# Altium schematic sheet GPS_NMEA.SchDoc
size B
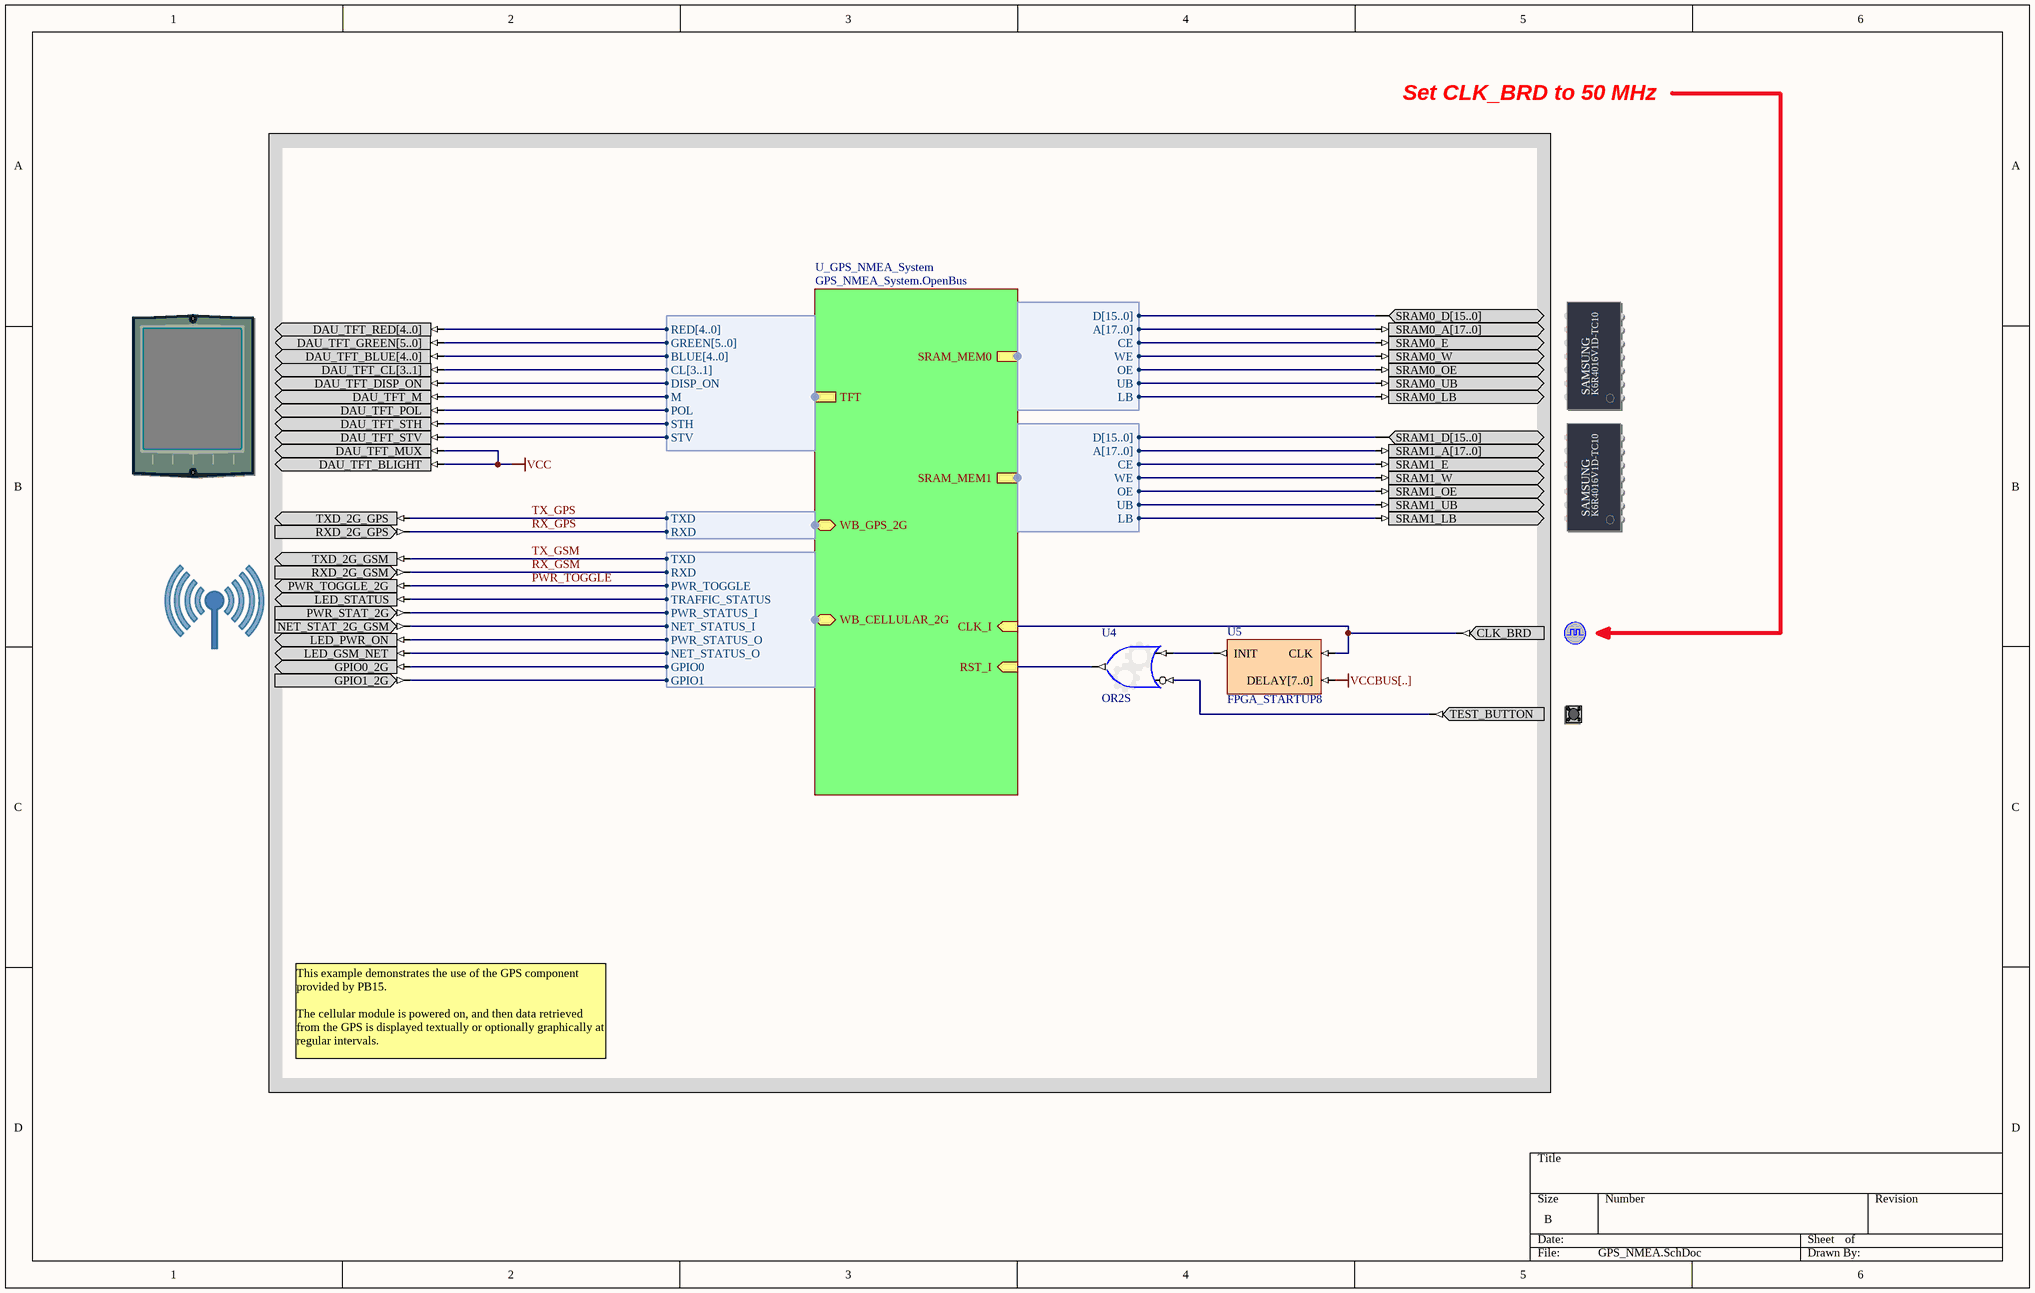
[diagram p0: GPS_NMEA.SchDoc]

## Parts
(Parts that share a designator on the sheet are numbered #1, #2 ... from top to bottom, then left to right.)
?#1  TFT_LCD  (value not drawn)
?#2  SRAM_DAUGHTER0  (value not drawn)
?#3  SRAM_DAUGHTER1  (value not drawn)
?#4  2G_GPS_COMP  (value not drawn)
?#5  2G_GSM_COMP  (value not drawn)
?#6  CLOCK_BOARD  (value not drawn)
?#7  TEST_BUTTON  (value not drawn)
U4  OR2S
U5  FPGA_STARTUP8

## Sub-sheets
U_GPS_NMEA_System = GPS_NMEA_System.OpenBus: SRAM_MEM0 (harness WB_MEM_CTRL_SRAM16_A18), SRAM_MEM1 (harness WB_MEM_CTRL_SRAM16_A18), TFT (harness VGA32_TFT), RST_I (in), CLK_I (in), WB_CELLULAR_2G (harness WB_CELLULAR_2G), WB_GPS_2G (harness WB_GPS_NMEA)

## Harnesses
WB_MEM_CTRL_SRAM16_A18: D[15..0], A[17..0], CE, WE, OE, UB, LB
VGA32_TFT: RED[4..0], GREEN[5..0], BLUE[4..0], CL[3..1], DISP_ON, M, POL, STH, STV
WB_CELLULAR_2G: TXD, RXD, PWR_TOGGLE, TRAFFIC_STATUS, PWR_STATUS_I, NET_STATUS_I, PWR_STATUS_O, NET_STATUS_O, GPIO0, GPIO1
WB_GPS_NMEA: RXD, TXD

## Nets
VCC: ?#1.DAU_TFT_BLIGHT ?#1.DAU_TFT_MUX
VCCBUS[..]: U5.DELAY[7..0]
PWR_TOGGLE: ?#5.PWR_TOGGLE_2G ; sheet U_GPS_NMEA_System/WB_CELLULAR_2G.PWR_TOGGLE
RX_GPS: ?#4.RXD_2G_GPS ; sheet U_GPS_NMEA_System/WB_GPS_2G.RXD
RX_GSM: ?#5.RXD_2G_GSM ; sheet U_GPS_NMEA_System/WB_CELLULAR_2G.RXD
TX_GPS: ?#4.TXD_2G_GPS ; sheet U_GPS_NMEA_System/WB_GPS_2G.TXD
TX_GSM: ?#5.TXD_2G_GSM ; sheet U_GPS_NMEA_System/WB_CELLULAR_2G.TXD
Net?#1_DAU_TFT_BLUE[4..0]: ?#1.DAU_TFT_BLUE[4..0] ; sheet U_GPS_NMEA_System/TFT.BLUE[4..0]
Net?#1_DAU_TFT_CL[3..1]: ?#1.DAU_TFT_CL[3..1] ; sheet U_GPS_NMEA_System/TFT.CL[3..1]
Net?#1_DAU_TFT_DISP_ON: ?#1.DAU_TFT_DISP_ON ; sheet U_GPS_NMEA_System/TFT.DISP_ON
Net?#1_DAU_TFT_GREEN[5..0]: ?#1.DAU_TFT_GREEN[5..0] ; sheet U_GPS_NMEA_System/TFT.GREEN[5..0]
Net?#1_DAU_TFT_M: ?#1.DAU_TFT_M ; sheet U_GPS_NMEA_System/TFT.M
Net?#1_DAU_TFT_POL: ?#1.DAU_TFT_POL ; sheet U_GPS_NMEA_System/TFT.POL
Net?#1_DAU_TFT_RED[4..0]: ?#1.DAU_TFT_RED[4..0] ; sheet U_GPS_NMEA_System/TFT.RED[4..0]
Net?#1_DAU_TFT_STH: ?#1.DAU_TFT_STH ; sheet U_GPS_NMEA_System/TFT.STH
Net?#1_DAU_TFT_STV: ?#1.DAU_TFT_STV ; sheet U_GPS_NMEA_System/TFT.STV
Net?#2_SRAM0_A[17..0]: ?#2.SRAM0_A[17..0] ; sheet U_GPS_NMEA_System/SRAM_MEM0.A[17..0]
Net?#2_SRAM0_D[15..0]: ?#2.SRAM0_D[15..0] ; sheet U_GPS_NMEA_System/SRAM_MEM0.D[15..0]
Net?#2_SRAM0_E: ?#2.SRAM0_E ; sheet U_GPS_NMEA_System/SRAM_MEM0.CE
Net?#2_SRAM0_LB: ?#2.SRAM0_LB ; sheet U_GPS_NMEA_System/SRAM_MEM0.LB
Net?#2_SRAM0_OE: ?#2.SRAM0_OE ; sheet U_GPS_NMEA_System/SRAM_MEM0.OE
Net?#2_SRAM0_UB: ?#2.SRAM0_UB ; sheet U_GPS_NMEA_System/SRAM_MEM0.UB
Net?#2_SRAM0_W: ?#2.SRAM0_W ; sheet U_GPS_NMEA_System/SRAM_MEM0.WE
Net?#3_SRAM1_A[17..0]: ?#3.SRAM1_A[17..0] ; sheet U_GPS_NMEA_System/SRAM_MEM1.A[17..0]
Net?#3_SRAM1_D[15..0]: ?#3.SRAM1_D[15..0] ; sheet U_GPS_NMEA_System/SRAM_MEM1.D[15..0]
Net?#3_SRAM1_E: ?#3.SRAM1_E ; sheet U_GPS_NMEA_System/SRAM_MEM1.CE
Net?#3_SRAM1_LB: ?#3.SRAM1_LB ; sheet U_GPS_NMEA_System/SRAM_MEM1.LB
Net?#3_SRAM1_OE: ?#3.SRAM1_OE ; sheet U_GPS_NMEA_System/SRAM_MEM1.OE
Net?#3_SRAM1_UB: ?#3.SRAM1_UB ; sheet U_GPS_NMEA_System/SRAM_MEM1.UB
Net?#3_SRAM1_W: ?#3.SRAM1_W ; sheet U_GPS_NMEA_System/SRAM_MEM1.WE
Net?#5_GPIO0_2G: ?#5.GPIO0_2G ; sheet U_GPS_NMEA_System/WB_CELLULAR_2G.GPIO0
Net?#5_GPIO1_2G: ?#5.GPIO1_2G ; sheet U_GPS_NMEA_System/WB_CELLULAR_2G.GPIO1
Net?#5_LED_GSM_NET: ?#5.LED_GSM_NET ; sheet U_GPS_NMEA_System/WB_CELLULAR_2G.NET_STATUS_O
Net?#5_LED_PWR_ON: ?#5.LED_PWR_ON ; sheet U_GPS_NMEA_System/WB_CELLULAR_2G.PWR_STATUS_O
Net?#5_LED_STATUS: ?#5.LED_STATUS ; sheet U_GPS_NMEA_System/WB_CELLULAR_2G.TRAFFIC_STATUS
Net?#5_NET_STAT_2G_GSM: ?#5.NET_STAT_2G_GSM ; sheet U_GPS_NMEA_System/WB_CELLULAR_2G.NET_STATUS_I
Net?#5_PWR_STAT_2G: ?#5.PWR_STAT_2G ; sheet U_GPS_NMEA_System/WB_CELLULAR_2G.PWR_STATUS_I
Net?#6_CLK_BRD: ?#6.CLK_BRD U5.CLK ; sheet U_GPS_NMEA_System/CLK_I
Net?#7_TEST_BUTTON: ?#7.TEST_BUTTON U4.I1
NetU4_I0: U4.I0 U5.INIT
NetU4_O: U4.O ; sheet U_GPS_NMEA_System/RST_I

## Notes on the sheet
- Set CLK_BRD to 50 MHz
- This example demonstrates the use of the GPS component provided by PB15.
  The cellular module is powered on, and then data retrieved from the GPS is displayed textually or optionally graphically at regular intervals.
- (in symbol SRAM_DAUGHTER0) SAMSUNG; K6R4016V1D-TC10
- (in symbol SRAM_DAUGHTER1) SAMSUNG; K6R4016V1D-TC10

## Library data of the parts
?#1 = TFT_LCD: TFT LCD Panel; PortComponent: True; Published: 22-Jan-2007; Publisher: Altium Limited; HelpURL: TR0143 Technical Reference Manual for Altium's Desktop NanoBoard NB2DSK01.pdf#page=50
?#2 = SRAM_DAUGHTER0: Free Static RAM - Daughterboard; PortComponent: True; Published: 14-May-2007; Publisher: Altium Limited; HelpURL: TR0149 Technical Reference for Altium's Xilinx Spartan-3 Daughter Board DB30.pdf#page=16
?#3 = SRAM_DAUGHTER1: Free Static RAM - Daughterboard; PortComponent: True; Published: 14-May-2007; Publisher: Altium Limited; HelpURL: TR0149 Technical Reference for Altium's Xilinx Spartan-3 Daughter Board DB30.pdf#page=16
?#4 = 2G_GPS_COMP: 2G GPS Component; PortComponent: True; Published: 22-Jan-2007; Publisher: Altium Limited; HelpURL: https://wiki.altium.com/display/ADOH/PB03+Resources+-+Ethernet+Port
?#5 = 2G_GSM_COMP: 2G GSM/GPRS Component; PortComponent: True; Published: 22-Jan-2007; Publisher: Altium Limited; HelpURL: https://wiki.altium.com/display/ADOH/PB03+Resources+-+Ethernet+Port
?#6 = CLOCK_BOARD: Global System Clock Supply; PortComponent: True; Published: 19-Nov-2003; Publisher: Altium Limited; HelpURL: TR0143 Technical Reference Manual for Altium's Desktop NanoBoard NB2DSK01.pdf#page=41; UseInDSF: True
?#7 = TEST_BUTTON: Test / Reset Button; PortComponent: True; Published: 19-Nov-2003; Publisher: Altium Limited; HelpURL: TR0143 Technical Reference Manual for Altium's Desktop NanoBoard NB2DSK01.pdf#page=53
U4 = GATE: Configurable Generic Gate; ConfiguratorName: GENERIC_GATE; ConfigurationParameters: {}Version[1.0]{}GateKind[OR]{}BusInput[False]{}GateInputType[Bit]{}GateOutputOption[Normal]{}BusWidth[8]{}RegisterOutputs[False]{}NegativeClockEdge[False]{}InputCount[2]{}InputInvert0[False]{}InputInvert1[True]{}; LastRevisionNo: 1.00.00; Published: 3-Sep-2008; Publisher: Altium Limited
U5 = FPGA_STARTUP8: FPGA Startup With 8 Bit Delay; Published: 9-Dec-2004; Publisher: Altium Limited; HelpURL: CR0119 FPGA_STARTUPx Powerup Delay Unit.pdf; LastRevisionNo: 1.00.00; ComponentLink1Description: Core &Resource Usage; ComponentLink1URL: CR0139 FPGA Peripheral Resource Usage.pdf#page=11